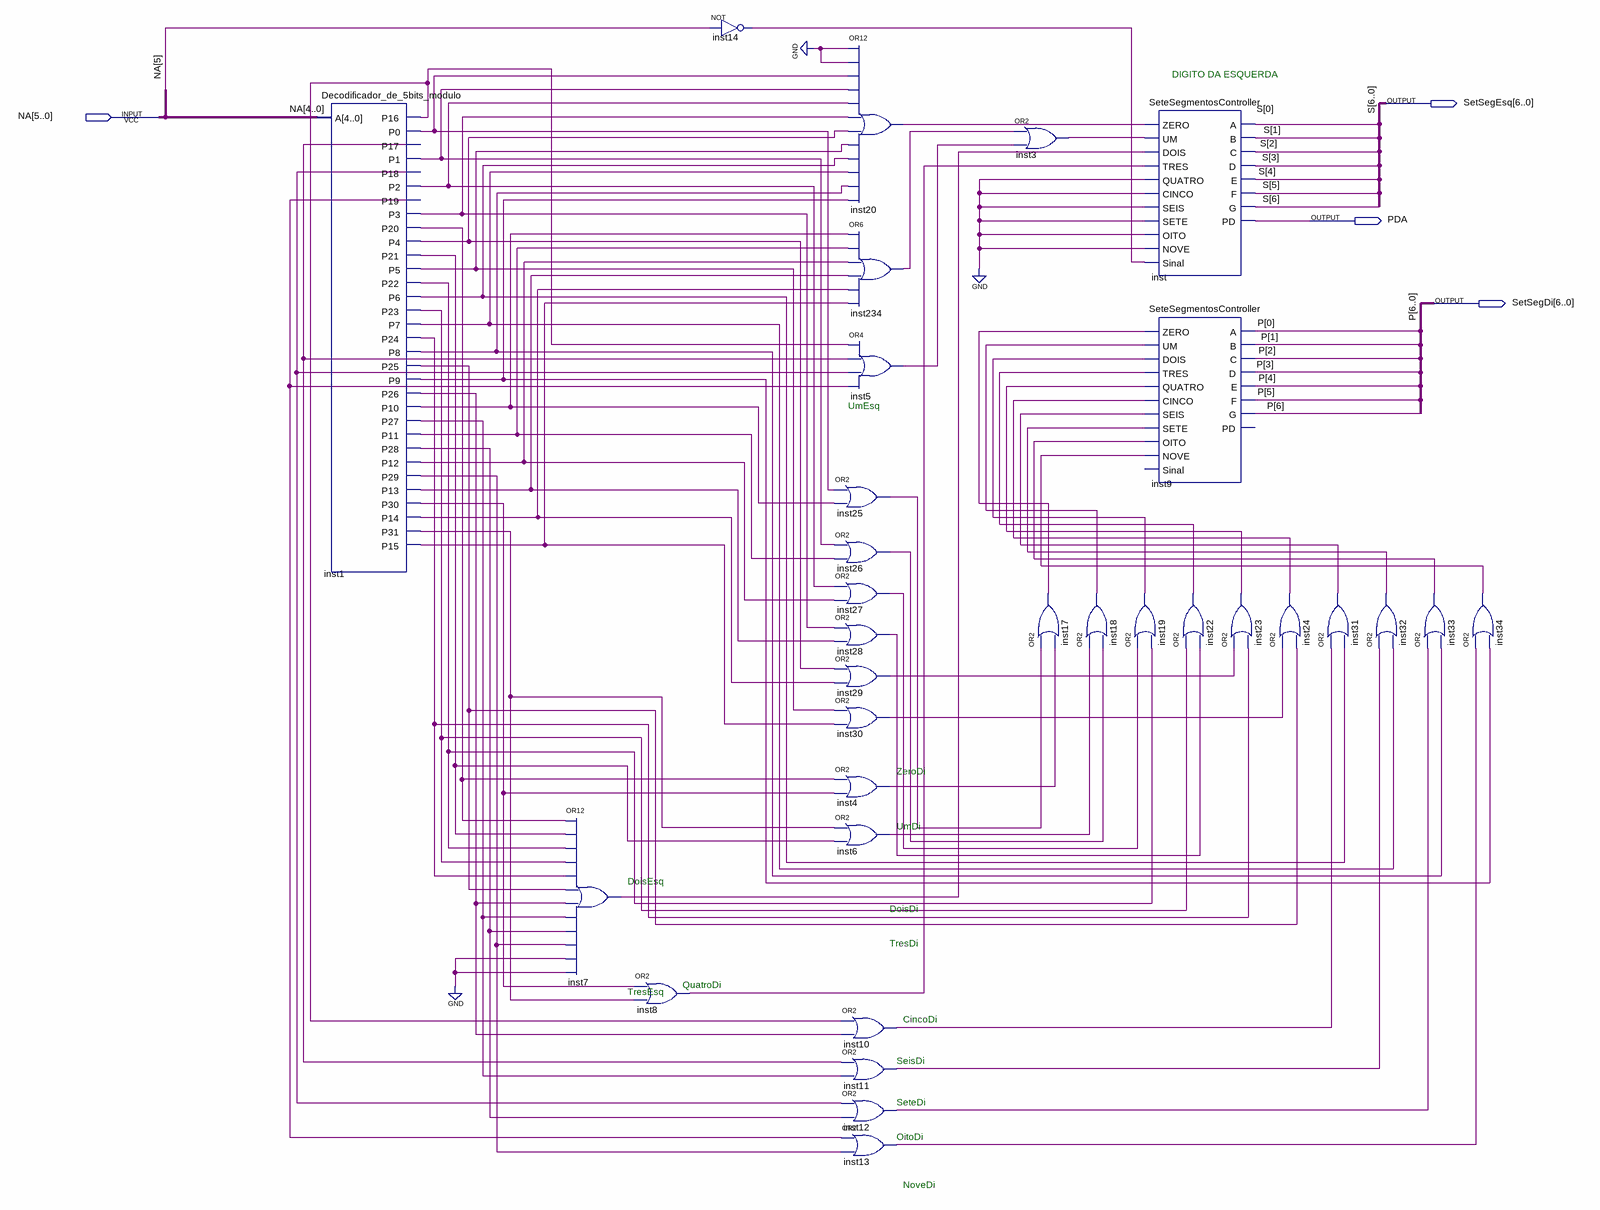
[diagram p0: schematic sheet]
// Quartus schematic Result_SeteSegmentos.bdf as structural Verilog: 32 symbols, 4 pins
module Result_SeteSegmentos (
  input  [5:0] NA,
  output [6:0] SetSegEsq,
  output PDA,
  output [6:0] SetSegDi
);

  wire inst1_p0, inst1_p1, inst1_p2, inst1_p3, inst1_p4, inst1_p5, inst1_p6, inst1_p7, inst1_p8, inst1_p9,
       inst1_p10, inst1_p11, inst1_p12, inst1_p13, inst1_p14, inst1_p15, inst1_p16, inst1_p17, inst1_p18,
       inst1_p19, inst1_p20, inst1_p21, inst1_p22, inst1_p23, inst1_p24, inst1_p25, inst1_p26, inst1_p27,
       inst1_p28, inst1_p29, inst1_p30, inst1_p31, inst3_out, inst4_out, inst5_out, inst6_out, inst7_out,
       inst8_out, inst10_out, inst11_out, inst12_out, inst13_out, inst14_out, inst17_out, inst18_out,
       inst19_out, inst20_out, inst22_out, inst23_out, inst24_out, inst25_out, inst26_out, inst27_out,
       inst28_out, inst29_out, inst30_out, inst31_out, inst32_out, inst33_out, inst34_out, inst234_out;

  Decodificador_de_5bits_modulo inst1 (
    .A(NA[4:0]), .P16(inst1_p16), .P0(inst1_p0), .P17(inst1_p17), .P1(inst1_p1), .P18(inst1_p18),
    .P2(inst1_p2), .P19(inst1_p19), .P3(inst1_p3), .P20(inst1_p20), .P4(inst1_p4), .P21(inst1_p21),
    .P5(inst1_p5), .P22(inst1_p22), .P6(inst1_p6), .P23(inst1_p23), .P7(inst1_p7), .P24(inst1_p24),
    .P8(inst1_p8), .P25(inst1_p25), .P9(inst1_p9), .P26(inst1_p26), .P10(inst1_p10), .P27(inst1_p27),
    .P11(inst1_p11), .P28(inst1_p28), .P12(inst1_p12), .P29(inst1_p29), .P13(inst1_p13), .P30(inst1_p30),
    .P14(inst1_p14), .P31(inst1_p31), .P15(inst1_p15));
  or inst7 (inst7_out, inst1_p20, inst1_p21, inst1_p22, inst1_p23, inst1_p24, inst1_p25, inst1_p26, inst1_p27, inst1_p28, inst1_p29, 1'b0, 1'b0);
  or inst8 (inst8_out, inst1_p30, inst1_p31);
  not inst14 (inst14_out, NA[5]);
  or inst25 (inst25_out, inst1_p0, inst1_p10);
  or inst26 (inst26_out, inst1_p1, inst1_p11);
  or inst27 (inst27_out, inst1_p2, inst1_p12);
  or inst28 (inst28_out, inst1_p3, inst1_p13);
  or inst29 (inst29_out, inst1_p4, inst1_p14);
  or inst30 (inst30_out, inst1_p5, inst1_p15);
  or inst4 (inst4_out, inst1_p20, inst1_p30);
  or inst6 (inst6_out, inst1_p31, inst1_p21);
  or inst10 (inst10_out, inst1_p16, inst1_p26);
  or inst11 (inst11_out, inst1_p17, inst1_p27);
  or inst12 (inst12_out, inst1_p18, inst1_p28);
  or inst13 (inst13_out, inst1_p19, inst1_p29);
  or inst20 (inst20_out, 1'b0, 1'b0, inst1_p0, inst1_p1, inst1_p2, inst1_p3, inst1_p4, inst1_p5, inst1_p6, inst1_p7, inst1_p8, inst1_p9);
  or inst234 (inst234_out, inst1_p10, inst1_p11, inst1_p12, inst1_p13, inst1_p14, inst1_p15);
  or inst5 (inst5_out, inst1_p16, inst1_p17, inst1_p18, inst1_p19);
  or inst3 (inst3_out, inst234_out, inst5_out);
  or inst17 (inst17_out, inst25_out, inst4_out);
  or inst18 (inst18_out, inst6_out, inst26_out);
  SeteSegmentosController inst (
    .ZERO(inst20_out), .UM(inst3_out), .DOIS(inst7_out), .TRES(inst8_out), .QUATRO(1'b0), .CINCO(1'b0),
    .SEIS(1'b0), .SETE(1'b0), .OITO(1'b0), .NOVE(1'b0), .Sinal(inst14_out), .A(SetSegEsq[0]),
    .B(SetSegEsq[1]), .C(SetSegEsq[2]), .D(SetSegEsq[3]), .E(SetSegEsq[4]), .F(SetSegEsq[5]),
    .G(SetSegEsq[6]), .PD(PDA));
  SeteSegmentosController inst9 (
    .ZERO(inst17_out), .UM(inst18_out), .DOIS(inst19_out), .TRES(inst22_out), .QUATRO(inst23_out),
    .CINCO(inst24_out), .SEIS(inst31_out), .SETE(inst32_out), .OITO(inst33_out), .NOVE(inst34_out),
    .A(SetSegDi[0]), .B(SetSegDi[1]), .C(SetSegDi[2]), .D(SetSegDi[3]), .E(SetSegDi[4]), .F(SetSegDi[5]),
    .G(SetSegDi[6]));  // open: Sinal, PD
  or inst19 (inst19_out, inst27_out, inst1_p22);
  or inst22 (inst22_out, inst1_p23, inst28_out);
  or inst23 (inst23_out, inst29_out, inst1_p24);
  or inst24 (inst24_out, inst30_out, inst1_p25);
  or inst31 (inst31_out, inst10_out, inst1_p6);
  or inst32 (inst32_out, inst11_out, inst1_p7);
  or inst33 (inst33_out, inst12_out, inst1_p8);
  or inst34 (inst34_out, inst13_out, inst1_p9);

  // Other names for the same wires on the sheet: P[6:0] = SetSegDi; S[6:0] = SetSegEsq

  // Notes on the sheet:
  //   DIGITO DA ESQUERDA
  //   UmEsq
  //   ZeroDi
  //   UmDi
  //   DoisEsq
  //   DoisDi
  //   TresDi
  //   QuatroDi
  //   TresEsq
  //   CincoDi
  //   SeisDi
  //   SeteDi
  //   OitoDi
  //   NoveDi
endmodule
